# EAGLE design DTUnodeSchematic (EAGLE 8.0.0)

## Sheet 1 of 3
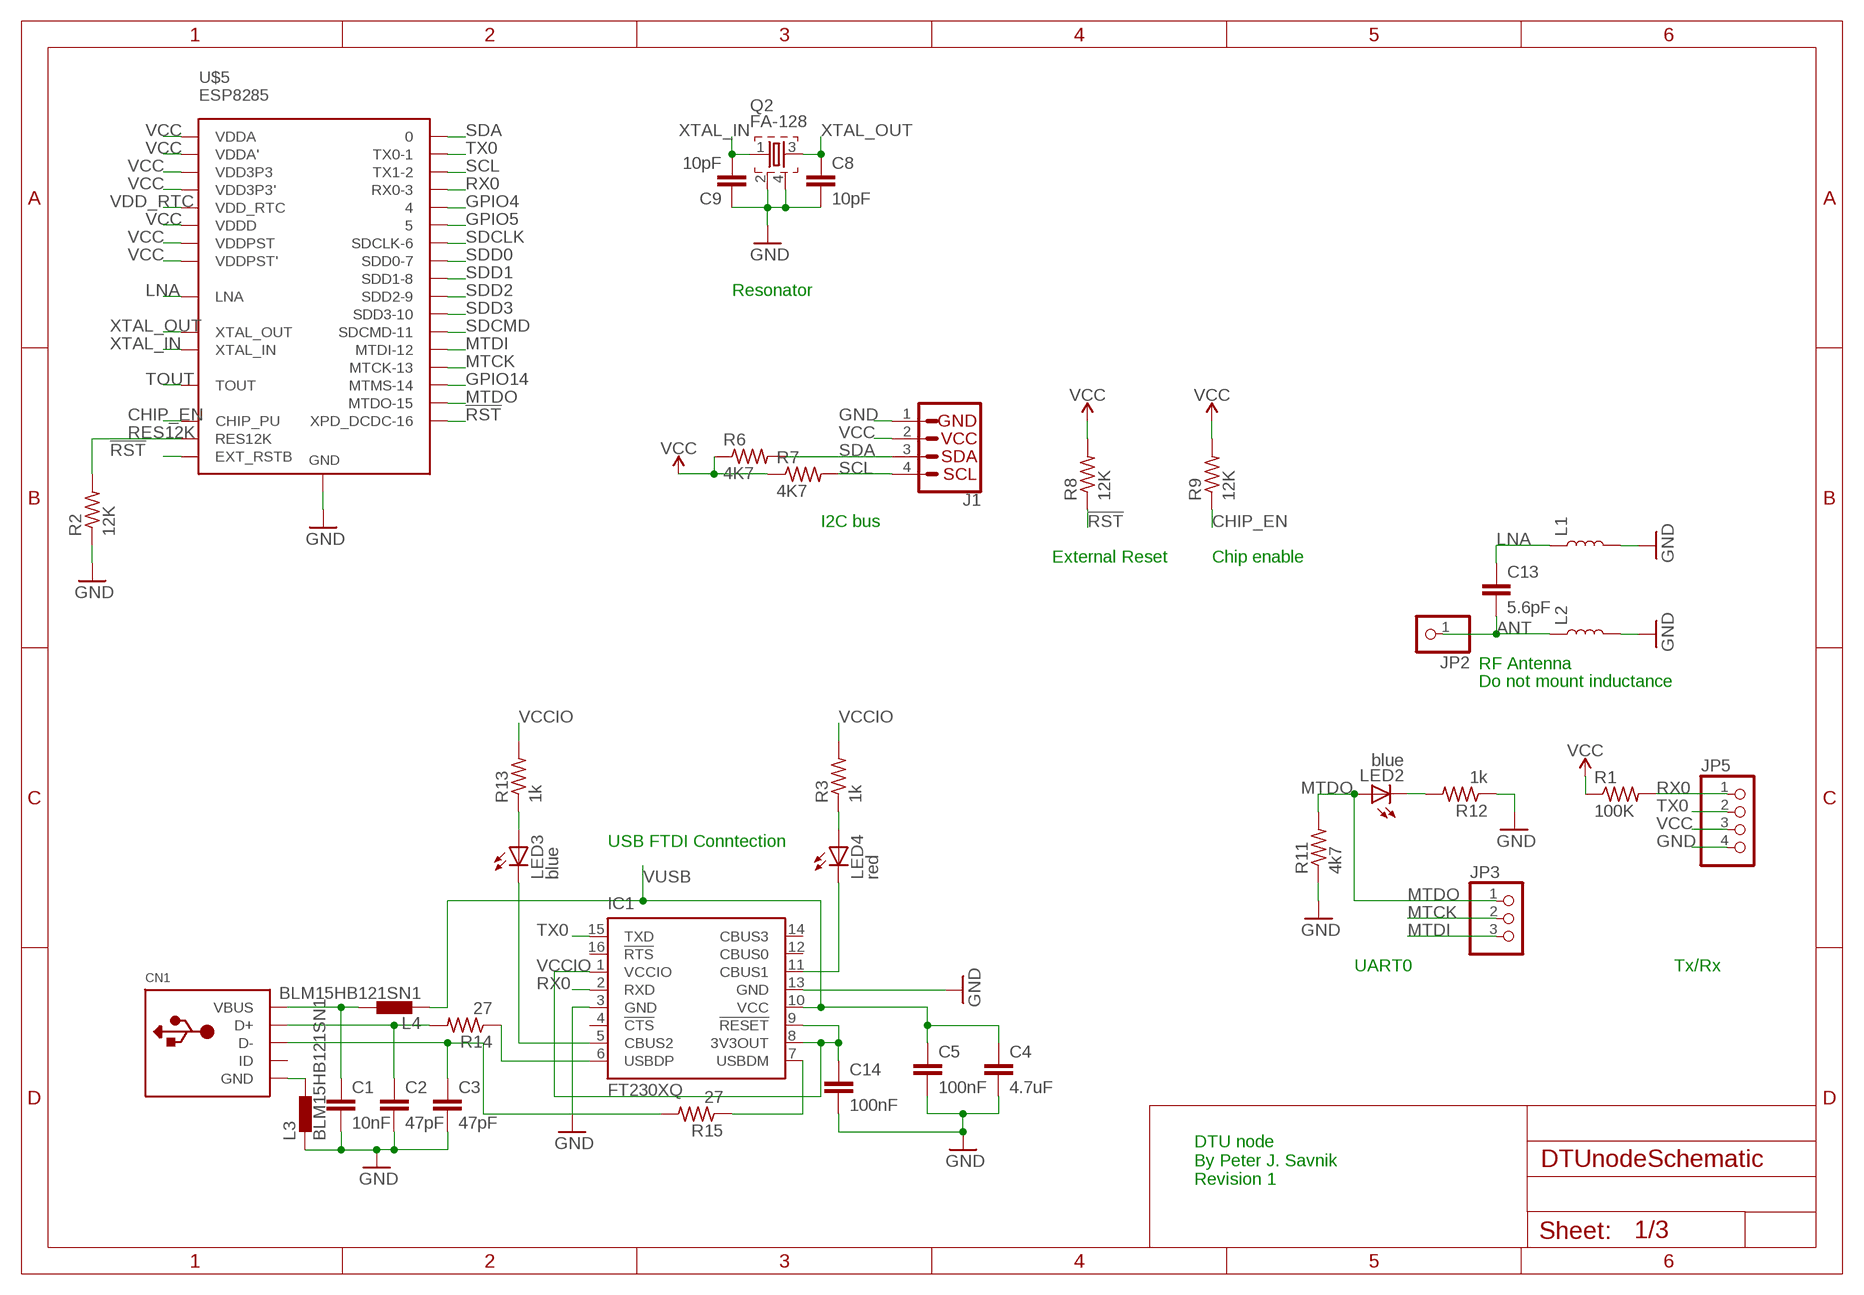
[diagram p0: schematic, sheet 1]

### Parts
C1  10nF  C-EUC0402K  [C0402K]
C2  47pF  C-EUC0402K  [C0402K]
C3  47pF  C-EUC0402K  [C0402K]
C4  4.7uF  C-EUC0402K  [C0402K]
C5  100nF  C-EUC0402K  [C0402K]
C8  10pF  C-EUC0402K  [C0402K]
C9  10pF  C-EUC0402K  [C0402K]
C13  5.6pF  C-EUC0402K  [C0402K]
C14  100nF  C-EUC0402K  [C0402K]
CN1  USBMINIB  [USB-MINIB]
IC1  FT230XQ  [QFN16]
J1  I2C_STANDARD  [1X04]
JP2  PINHD-1X1  [1X01]
JP3  PINHD-1X3  [1X03]
JP5  PINHD-1X4  [1X04]
L1  INDUCTOR-0402-3.9NH  [0402]
L2  INDUCTOR-0402-3.9NH  [0402]
L3  BLM15HB121SN1  [0402]
L4  BLM15HB121SN1  [0402]
LED2  blue  LEDCHIP-LED0603  [CHIP-LED0603]
LED3  blue  LEDCHIP-LED0603  [CHIP-LED0603]
LED4  red  LEDCHIP-LED0603  [CHIP-LED0603]
Q2  FA-128  [FA-128]
R1  100K  R-US_R0402  [R0402]
R2  12K  R-US_R0402  [R0402]
R3  1k  R-US_R0402  [R0402]
R6  4K7  R-US_R0402  [R0402]
R7  4K7  R-US_R0402  [R0402]
R8  12K  R-US_R0402  [R0402]
R9  12K  R-US_R0402  [R0402]
R11  4k7  R-US_R0402  [R0402]
R12  1k  R-US_R0402  [R0402]
R13  1k  R-US_R0402  [R0402]
R14  27  R-US_R0402  [R0402]
R15  27  R-US_R0402  [R0402]
U$5  ESP8285  [QFN-32]

### Nets
!RST: R8.1 U$5.P$8(XPD_DCDC-16) U$5.P$32(EXT_RSTB)
ANT: C13.2 JP2.1 L2.1
CHIP_EN: R9.1 U$5.P$7(CHIP_PU)
GND: C1.2 C2.2 C3.2 C4.2 C5.2 C8.2 C9.1 C14.2 IC1.3(GND) IC1.13(GND) J1.1 JP5.4 L1.2 L2.2 L3.1 Q2.2 Q2.4 R2.1 R11.1 R12.1 U$5.33-GND(GND) ; also sheet 2,3
GPIO4: U$5.P$16
GPIO5: U$5.P$24
GPIO14: U$5.P$9(MTMS-14)
LNA: C13.1 L1.1 U$5.P$2(LNA)
MTCK: JP3.2 U$5.P$12(MTCK-13)
MTDI: JP3.3 U$5.P$10(MTDI-12)
MTDO: JP3.1 LED2.A R11.2 U$5.P$13(MTDO-15)
N$1: CN1.GND L3.2
N$2: IC1.6(USBDP) R14.1
N$4: C1.1 CN1.VBUS L4.2
N$5: C2.1 CN1.D+ R14.2
N$7: C3.1 CN1.D- R15.2
N$8: LED2.C R12.2
N$9: IC1.7(USBDM) R15.1
N$16: LED3.A R13.1
N$17: LED4.A R3.1
N$18: IC1.5(CBUS2) LED3.C
N$19: IC1.11(CBUS1) LED4.C
RES12K: R2.2 U$5.P$31(RES12K)
RX0: IC1.2(RXD) R1.2 U$5.P$25(RX0-3)
SCL: J1.4 R7.2 U$5.P$14(TX1-2) ; also sheet 3
SDA: J1.3 R6.2 U$5.P$15 ; also sheet 3
SDCLK: U$5.P$21(SDCLK-6)
SDCMD: U$5.P$20(SDCMD-11)
SDD0: U$5.P$22(SDD0-7)
SDD1: U$5.P$23(SDD1-8)
SDD2: U$5.P$18(SDD2-9)
SDD3: U$5.P$19(SDD3-10)
TOUT: U$5.P$6(TOUT) ; also sheet 2
TX0: IC1.15(TXD) JP5.2 U$5.P$26(TX0-1)
VCC: J1.2 JP5.3 R1.1 R6.1 R7.1 R8.2 R9.2 U$5.P$1(VDDA) U$5.P$3(VDD3P3) U$5.P$4(VDD3P3') U$5.P$11(VDDPST) U$5.P$17(VDDPST') U$5.P$29(VDDD) U$5.P$30(VDDA') ; also sheet 2,3
VCCIO: C14.1 IC1.1(VCCIO) IC1.8(3V3OUT) IC1.9(!RESET) R3.2 R13.2
VDD_RTC: U$5.P$5(VDD_RTC)
VUSB: C4.1 C5.1 IC1.10(VCC) L4.1 ; also sheet 2
XTAL_IN: C9.2 Q2.1 U$5.P$28(XTAL_IN)
XTAL_OUT: C8.1 Q2.3 U$5.P$27(XTAL_OUT)
Unconnected: CN1.ID IC1.4(!CTS) IC1.12(CBUS0) IC1.14(CBUS3) IC1.16(!RTS) JP5.1

### Notes on the sheet
- Resonator
- I2C bus
- External Reset | Chip enable
- RF Antenna
- Do not mount inductance
- USB FTDI Conntection
- UART0 | Tx/Rx
- DTU node
  By Peter J. Savnik
  Revision 1

## Sheet 2 of 3
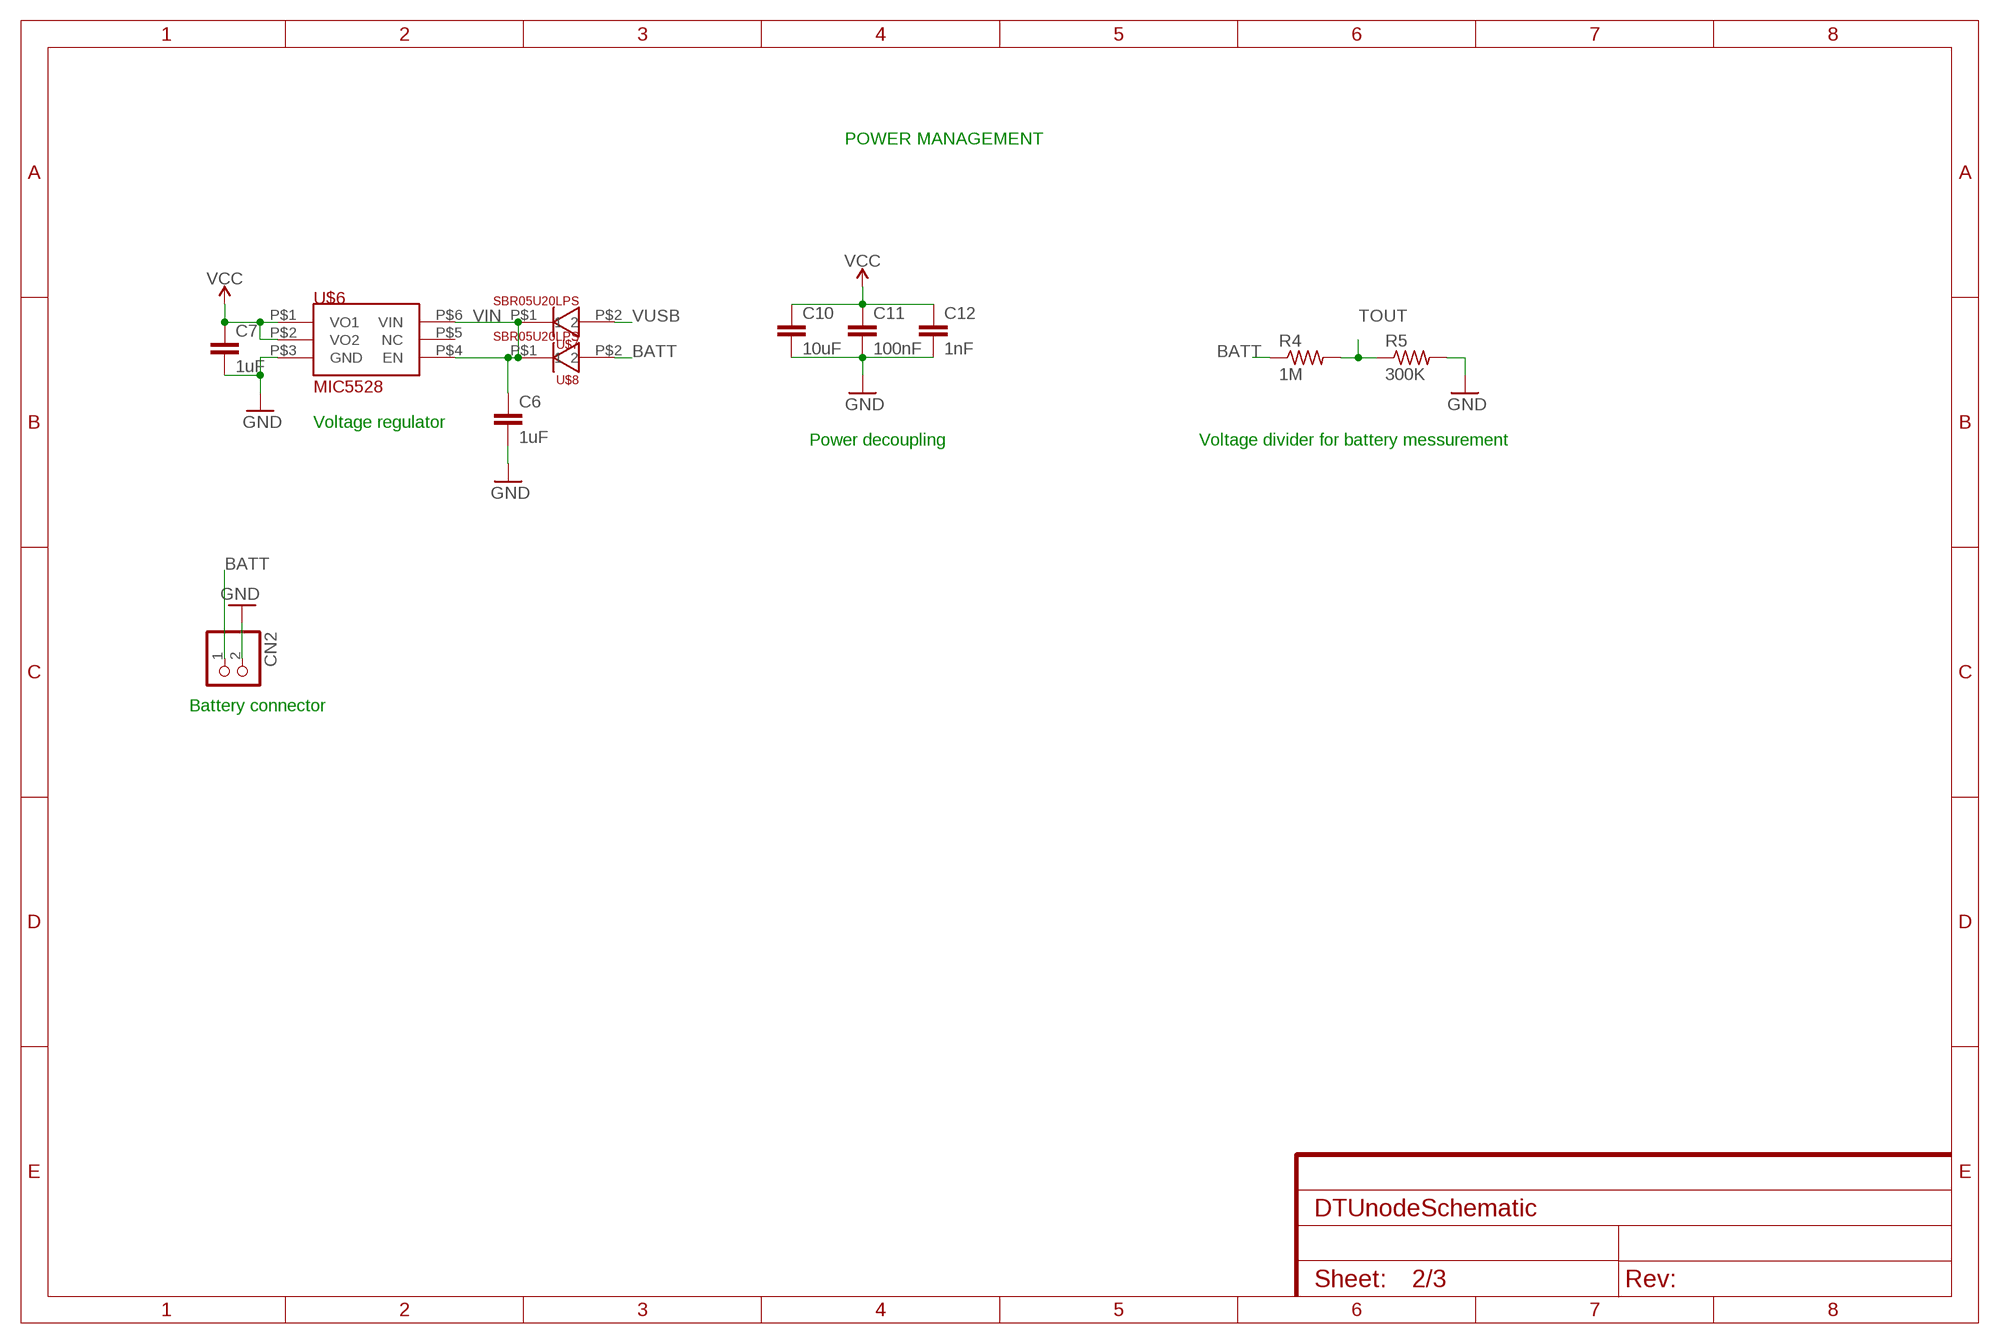
[diagram p1: schematic, sheet 2]

### Parts
C6  1uF  C-EUC0402K  [C0402K]
C7  1uF  C-EUC0402K  [C0402K]
C10  10uF  C-EUC0402K  [C0402K]
C11  100nF  C-EUC0402K  [C0402K]
C12  1nF  C-EUC0402K  [C0402K]
CN2  JST_2PIN-THM-RA  [JST-PH-2-THM-RA]
R4  1M  R-US_R0402  [R0402]
R5  300K  R-US_R0402  [R0402]
U$6  MIC5528  [6-PIN_1.2MMX1.2MM_THIN_FDN(MT)]
U$7  SBR05U20LPS  [X2-DFN1006-2]
U$8  SBR05U20LPS  [X2-DFN1006-2]

### Nets
BATT: CN2.1 R4.1 U$8.P$2
GND: C6.2 C7.2 C10.2 C11.2 C12.2 CN2.2 R5.2 U$6.P$3(GND) ; also sheet 1,3
TOUT: R4.2 R5.1 ; also sheet 1
VCC: C7.1 C10.1 C11.1 C12.1 U$6.P$1(VO1) U$6.P$2(VO2) ; also sheet 1,3
VIN: C6.1 U$6.P$4(EN) U$6.P$6(VIN) U$7.P$1 U$8.P$1
VUSB: U$7.P$2 ; also sheet 1
Unconnected: U$6.P$5(NC)

### Notes on the sheet
- POWER MANAGEMENT
- Voltage regulator
- Power decoupling | Voltage divider for battery messurement
- Battery connector

## Sheet 3 of 3
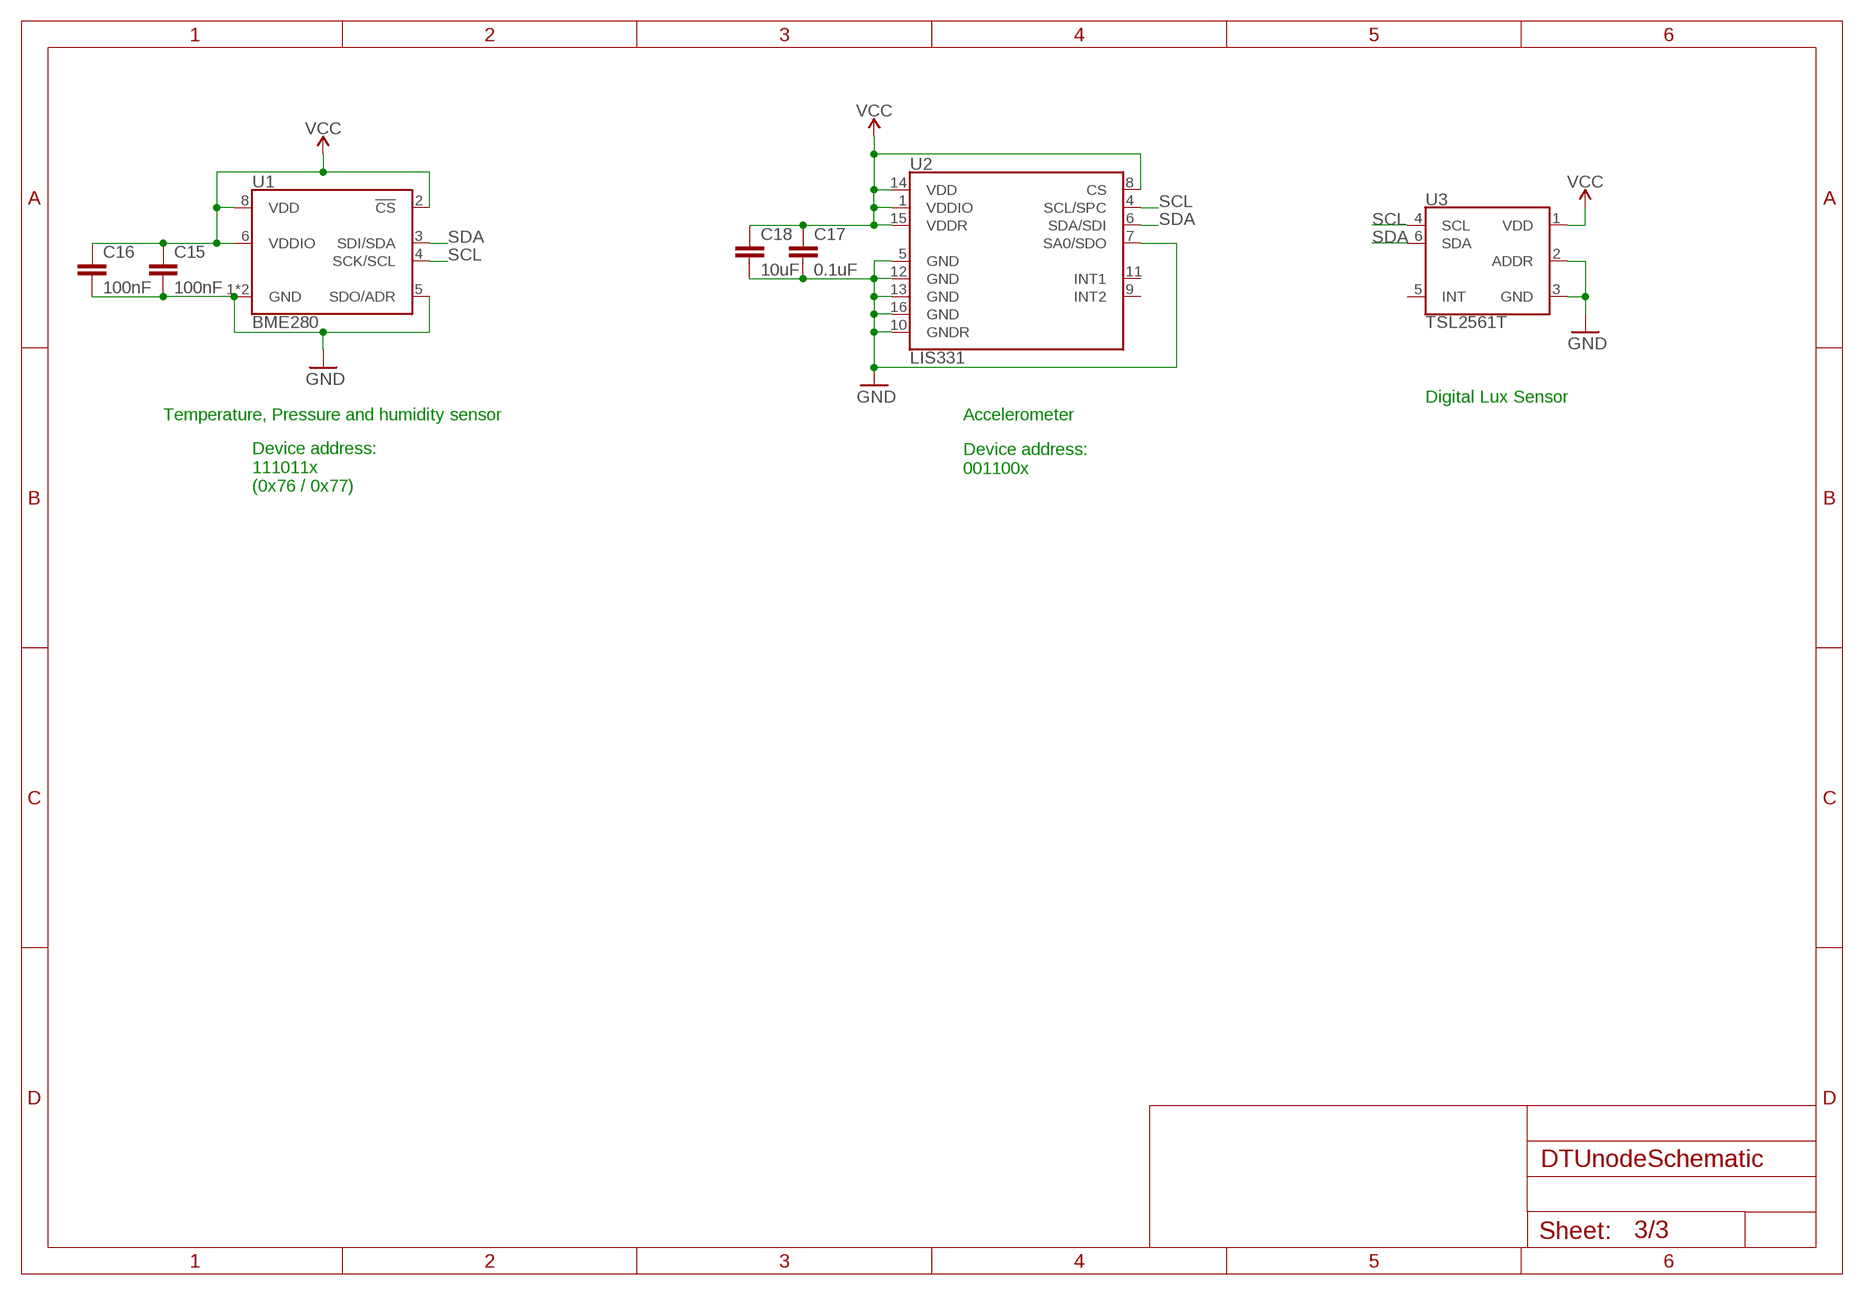
[diagram p2: schematic, sheet 3]

### Parts
C15  100nF  C-EUC0402  [C0402]
C16  100nF  C-EUC0402  [C0402]
C17  0.1uF  C-EUC0402  [C0402]
C18  10uF  C-EUC0402  [C0402]
U1  BME280  [LGA-8-2.5X2.5]
U2  LIS331  [LGA-16-3X3]
U3  TSL2561T  [TMB-6]

### Nets
GND: C15.2 C16.2 C17.2 C18.2 U1.1(GND) U1.5(SDO/ADR) U1.7(GND) U2.5(GND) U2.7(SA0/SDO) U2.10(GNDR) U2.12(GND) U2.13(GND) U2.16(GND) U3.2(ADDR) U3.3(GND) ; also sheet 1,2
SCL: U1.4(SCK/SCL) U2.4(SCL/SPC) U3.4(SCL) ; also sheet 1
SDA: U1.3(SDI/SDA) U2.6(SDA/SDI) U3.6(SDA) ; also sheet 1
VCC: C15.1 C16.1 C17.1 C18.1 U1.2(!CS) U1.6(VDDIO) U1.8(VDD) U2.1(VDDIO) U2.8(CS) U2.14(VDD) U2.15(VDDR) U3.1(VDD) ; also sheet 1,2
Unconnected: U2.9(INT2) U2.11(INT1) U3.5(INT)

### Notes on the sheet
- Digital Lux Sensor
- Temperature, Pressure and humidity sensor | Accelerometer
- Device address:
  001100x
- Device address:
  111011x
  (0x76 / 0x77)

## Library data of the parts
C1 = resistor:C-EU: CAPACITOR, European symbol; MF: MULTICOMP; MPN: MC1206B103K102CT; OC_FARNELL: 1855902
C2-C14 = resistor:C-EU: CAPACITOR, European symbol; OC_FARNELL: unknown
C15-C18 = resistor:C-EU: CAPACITOR, European symbol
CN1 = adafruit:USB: USB Connectors USBMINIB - Surface Mount Female Mini-B USB Connector 4UConnector: 06564 By microbuilder.eu Thru-hole RA Female Mini-B USB Connector 4UConnector: 18732 By ladyada.net; OC_FARNELL: unknown
CN2 = adafruit:JST_2PIN: JST 2-Pin Connectors of various flavors SMT-RA (S2B-PH-SM4) 4UConnector #17311 SMT (B2B-PH-SM4) THM-RA (S2B-PH) THM (B2B-PH); OC_FARNELL: unknown
IC1 = ftdichip:FT230X: USB to BASIC UART IC Auto generated by make-symbol-device-package-bsdl.ulp Rev. 43 Source: Data sheet <http://www.ftdichip.com/Support/Documents/DataSheets/ICs/DS_FT230X.pdf>; OC_FARNELL: unknown
J1 = SparkFun-Connectors:I2C_STANDARD: SparkFun I2C Standard Pinout Header SparkFun has standardized on a pinout for all I2C based sensor breakouts. This pinout allows I2C boards to be plugged directly into the headers on Arduino Uno compatible boards, and to be daisy chained easily. Example SparkFun Products: SparkFun Atmospheric Sensor Breakout - BME280 <https://www.sparkfun.com/products/13676> SparkFun Altitude/Pressure Sensor Breakout - MPL3115A2 <https://www.sparkfun.com/products/11084> SparkFun TOF Range Finder Sensor - VL6180 <https://www.sparkfun.com/products/12785>
JP2 = adafruit:PINHD-1X1: Pin header 1x1 for 0.1" spacing With round pins; OC_FARNELL: unknown
JP3 = adafruit:PINHD-1X3: PIN HEADER; OC_FARNELL: unknown
JP5 = pinhead:PINHD-1X4: PIN HEADER
L1 L2 = SparkFun-Coils:INDUCTOR: Inductors Resist changes in electrical current. Basically a coil of wire. SparkFun Products: SparkFun Load Cell Amplifier - HX711 <https://www.sparkfun.com/products/13879> IOIO-OTG - V2.2 <https://www.sparkfun.com/products/13613>; OC_FARNELL: unknown; PROD_ID: NDUC-13457; VALUE: 3.9NH
L3 L4 = inductors:BLM15H: EMIFIL (R) Chip Ferrite Bead for GHz Noise Source: http://www.murata.com/ Ferrite Bead BLM15H.pdf; OC_FARNELL: unknown
LED2-LED4 = adafruit:LED: LED OSRAM: - CHIPLED LG R971, LG N971, LY N971, LG Q971, LY Q971, LO R971, LY R971 LH N974, LH R974 LS Q976, LO Q976, LY Q976 LO Q996 - Hyper CHIPLED LW Q18S LB Q993, LB Q99A, LB R99A - SideLED LS A670, LO A670, LY A670, LG A670, LP A670 LB A673, LV A673, LT A673, LW A673 LH A674 LY A675 LS A676, LA A676, LO A676, LY A676, LW A676 LS A679, LY A679, LG A679 - Hyper Micro SIDELED® LS Y876, LA Y876, LO Y876, LY Y876 LT Y87S - SmartLED LW L88C, LW L88S LB L89C, LB L89S, LG L890 LS L89K, LO L89K, LY L89K LS L896, LA L896, LO L896, LY L896 - TOPLED LS T670, LO T670, LY T670, LG T670, LP T670 LSG T670, LSP T670, LSY T670, LOP T670, LYG T670 LG T671, LOG T671, LSG T671 LB T673, LV T673, LT T673, LW T673 LH T674 LS T676, LA T676, LO T676, LY T676, LB T676, LH T676, LSB T676, LW T676 LB T67C, LV T67C, LT T67C, LS T67K, LO T67K, LY T67K, LW E67C LS E67B, LA E67B, LO E67B, LY E67B, LB E67C, LV E67C, LT E67C LW T67C LS T679, LY T679, LG T679 LS T770, LO T770, LY T770, LG T770, LP T770 LB T773, LV T773, LT T773, LW T773 LH T774 LS E675, LA E675, LY E675, LS T675 LS T776, LA T776, LO T776, LY T776, LB T776 LHGB T686 LT T68C, LB T68C - Hyper Mini TOPLED® LB M676 - Mini TOPLED Santana® LG M470 LS M47K, LO M47K, LY M47K Source: http://www.osram.convergy.de/; OC_FARNELL: unknown
Q2 = crystal:FA-: MHz RANGE CRYSTAL UNIT Source: Epson Toyocom; OC_FARNELL: unknown
R1-R9 R11-R15 = resistor:R-US_: RESISTOR, American symbol; OC_FARNELL: unknown
U1 = SparkFun-Sensors:BME280: Bosch BME280 – Combined Humidity and Pressure Sensor The BME280 is as combined digital humidity, pressure and temperature sensor based on proven sensing principles. The sensor module is housed in an extremely compact metal-lid LGA package with a footprint of only 2.5×2.5mm² with a height of 0.93mm. Its small dimensions and its low power consumption allow the implementation in battery driven devices such as handsets, GPS modules or watches. Datasheet <https://cdn.sparkfun.com/assets/learn_tutorials/4/1/9/BST-BME280_DS001-10.pdf> SparkFun Products SparkFun Atmospheric Sensor Breakout - BME280 <https://www.sparkfun.com/products/13676> (SEN-13676); PROD_ID: IC-13090
U2 = SparkFun-Sensors:LIS331: ST Microelectronics LIS331 3-Axis ±6/12/24g SPI/I2C Accelerometer The LIS331HH is an ultra low-power full-scale three axis MEMS linear accelerometer. It has a digital I2C/SPI serial interface which makes it ideal for using in embedded applications. The device also features ultra low-power operational modes that allow advanced power saving and smart sleep to wake-up functions. Datasheet <http://www.sparkfun.com/datasheets/Sensors/Accelerometer/LIS331HH.pdf> SparkFun Products SparkFun Triple Axis Accelerometer Breakout - LIS331 <https://www.sparkfun.com/products/10345> (SEN-10345) Triple Axis Accelerometer - LIS331HH <https://www.sparkfun.com/products/9755> (SEN-09755); PROD_ID: IC-12675; SF_ID: COM-09755
U3 = SparkFun-Sensors:TSL2561: TAOS TSL2561 Digital Luminosity (Light) Sensor The TSL2561 is a light-to-digital converter that transform light intensity to a digital signal output via I2C interface. The device combines one broadband photodiode (visible plus infrared) and one infrared-responding photodiode on a single CMOS integrated circuit capable of providing a near-photopic response over an effective 20-bit dynamic range (16-bit resolution). Two integrating ADCs convert the photodiode currents to a digital output that represents the irradiance measured on each channel. This digital output can be input to a microprocessor where illuminance (ambient light level) in lux is derived using an empirical formula to approximate the human eye response. The TSL2561 device supports a traditional level style interrupt that remains asserted until the firmware clears it. Datasheet <http://www.mouser.com/ds/2/588/ams_sl2560-e58-488842.pdf> SparkFun Products SparkFun Luminosity Sensor Breakout - TSL2561 <https://www.sparkfun.com/products/12055> (SEN-12055)
U$5 = Ma-ESP8285:ESP8285: ESP8285 Microcontroller with wifi and 1M flash by Espressif; OC_FARNELL: unknown
U$6 = micrel:MIC5528: Microchip Technology MIC5528 500mA High-Performance LDO Microchip MIC5528 500mA High-Performance LDO is a low-power, µCap, low dropout regulator designed for optimal performance in a very small footprint. It is capable of sourcing up to 500mA of output current while only drawing 38µA of operating current. This high-performance LDO is a µCap design in a thermally enhanced 1.2mmx1.2mm extra thin (0.4mm height) DFN package. It operates with small ceramic output capacitor for stability, thereby reducing required board space. Ideal for battery-operated applications, the MIC5528 offers ±2% accuracy, extremely low dropout voltage (260mV @ 500mA), and can regulate output voltage down to 1.0V. Equipped with a TTL logic-compatible enable pin, the MIC5528 can be put into a zero-off-mode current state, drawing no current when disabled.; OC_FARNELL: unknown
U$7 U$8 = Diodes_Inc_By_element14_Batch_1:SBR05U20LPS: SURFACE MOUNT SUPER BARRIER RECTIFIER Ultra-Low Forward Voltage Drop Superior Reverse Avalanche Capability Patented Super Barrier Rectifier Technology Soft, Fast Switching Capability +150°C Operating Junction Temperature Totally Lead-Free & Fully RoHS Compliant (Notes 1 & 2) Halogen and Antimony Free. “Green” Device (Note 3); OC_FARNELL: unknown

## Board
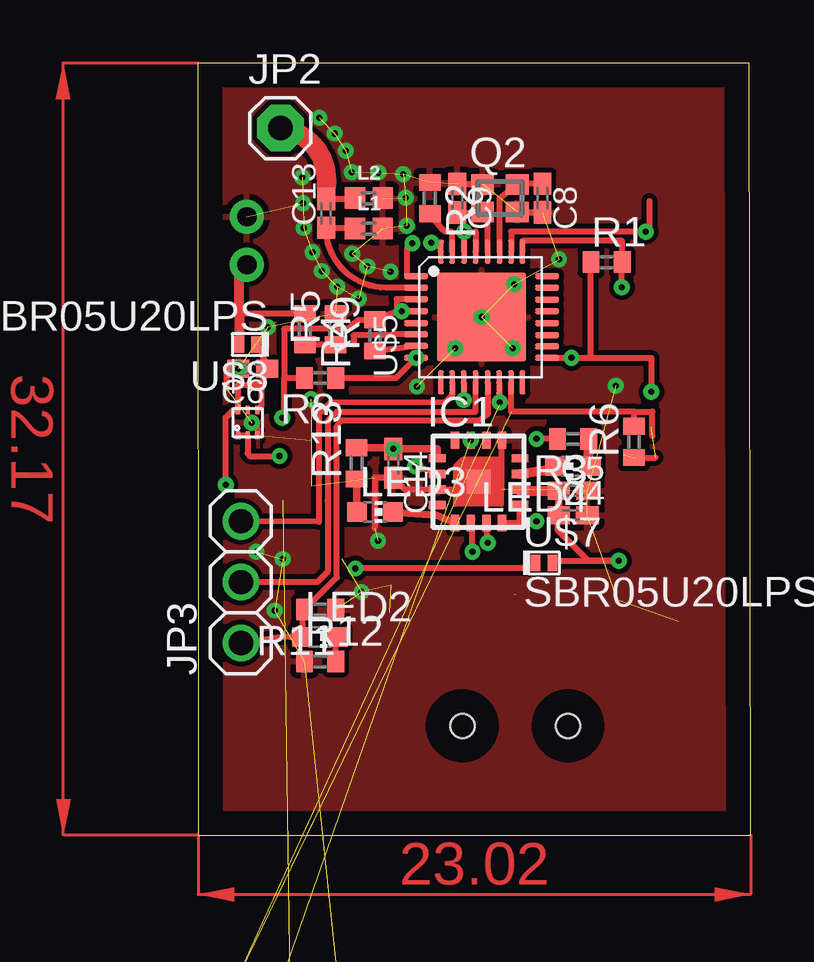
[diagram p3: board, top side]
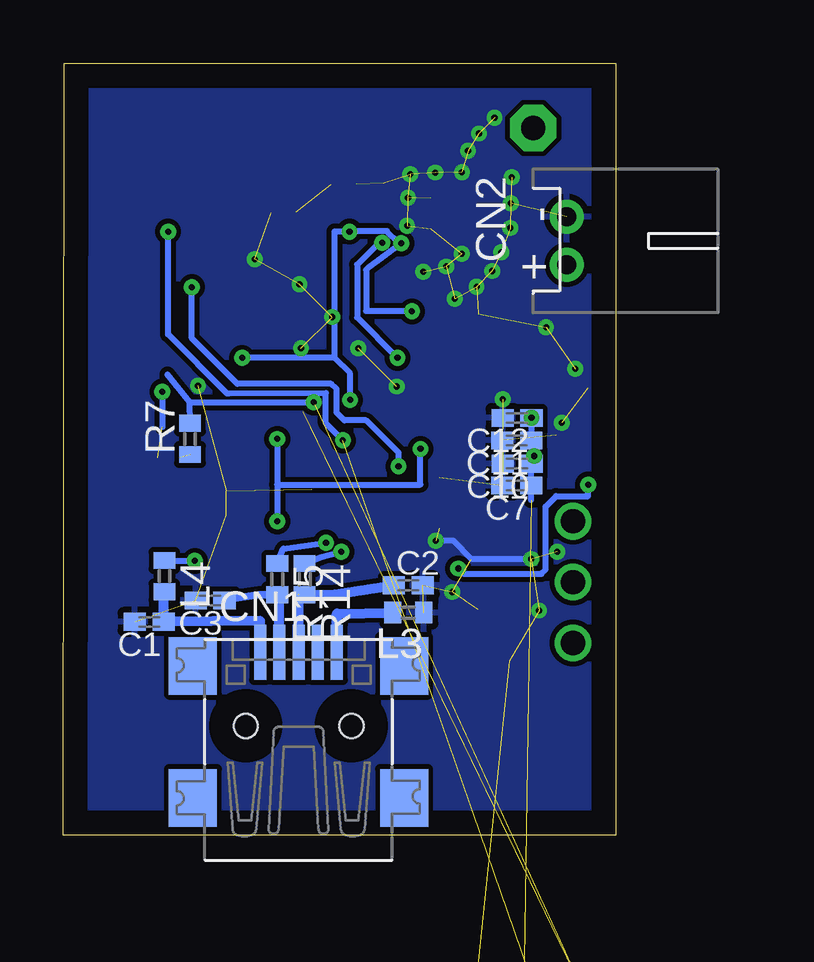
[diagram p4: board, bottom side, seen from below]

Size 23.03 x 32.17 mm. Coordinates in mm from the lower left corner, seen from the top.
Outline: 0.01,0 23.03,0 22.98,32.16 0,32.17 0.01,0
Copper layers (1*16): Top 0.035mm / dielectric 1.5mm / Bottom 0.035mm
Design rules "default": minimum track width 10mil, minimum drill 24mil, track to track 8mil, track to pad 8mil, pad to pad 8mil, via to via 8mil, smd to smd 8mil, copper to edge 40mil, drill to drill 8mil, minimum pad ring 10mil, minimum via ring 8mil, stop-mask expansion 4mil, vias tented up to drill 0mil, thermal gap 10mil

### Footprints (pad centres in the part's own frame; a part is rotated, then mirrored left to right if it is on the bottom)
C0402K = smd 0.925 x 0.74: 1 -0.6,0; 2 0.6,0
C0402 = smd 0.7 x 0.9: 1 -0.65,0; 2 0.65,0
USB-MINIB = smd 0.5 x 2.308: D+ 0,4.064; D- -0.8,4.064; GND 1.6,4.064; ID 0.8,4.064; VBUS -1.6,4.064 | smd 2 x 2.4: GND1 -4.4,-2; GND2 -4.4,3.5; GND3 4.4,3.5; GND4 4.4,-2 | hole 1: -2.2,1; 2.2,1
JST-PH-2-THM-RA = drill 0.8 pad 1.422: 1 1,0; 2 -1,0
QFN16 = smd 0.7 x 0.35: 1 -1.725,0.975; 2 -1.725,0.325; 3 -1.725,-0.325; 4 -1.725,-0.975; 9 1.725,-0.975; 10 1.725,-0.325; 11 1.725,0.325; 12 1.725,0.975 | smd 0.35 x 0.7: 5 -0.975,-1.725; 6 -0.325,-1.725; 7 0.325,-1.725; 8 0.975,-1.725; 13 0.975,1.725; 14 0.325,1.725; 15 -0.325,1.725; 16 -0.975,1.725 | smd 1 x 1: TAB 0,0
1X04 = drill 1.016 pad 1.88: 1 0,0; 2 2.54,0; 3 5.08,0; 4 7.62,0
1X01 = drill 1.016 pad 1.93 octagon: 1 0,0
1X03 = drill 1.016: 1 -2.54,0; 2 0,0; 3 2.54,0
1X04' = drill 1.016 long: 1 -3.81,0; 2 -1.27,0; 3 1.27,0; 4 3.81,0
0402 = smd 0.85 x 0.9: 1 -0.58,0; 2 0.58,0
0402' = smd 0.7 x 0.9: 1 -0.65,0; 2 0.65,0
CHIP-LED0603 = smd 0.8 x 0.8: A 0,-0.75; C 0,0.75
FA-128 = smd 0.95 x 0.85: 1 -0.725,-0.575; 2 0.725,-0.575; 3 0.725,0.575; 4 -0.725,0.575
R0402 = smd 0.7 x 0.9: 1 -0.65,0; 2 0.65,0
LGA-8-2.5X2.5 = smd 0.35 x 0.5: 1 -0.975,1.025; 2 -0.325,1.025; 3 0.325,1.025; 4 0.975,1.025; 5 0.975,-1.025; 6 0.325,-1.025; 7 -0.325,-1.025; 8 -0.975,-1.025
LGA-16-3X3 = smd 0.7 x 0.28: 1 -1.4,1; 2 -1.4,0.5; 3 -1.4,0; 4 -1.4,-0.5; 5 -1.4,-1; 9 1.4,-1; 10 1.4,-0.5; 11 1.4,0; 12 1.4,0.5; 13 1.4,1 | smd 0.28 x 0.7: 6 -0.5,-1.4; 7 0,-1.4; 8 0.5,-1.4; 14 0.5,1.4; 15 0,1.4; 16 -0.5,1.4
TMB-6 = smd 1.6 x 0.7: 1 -1.8,0.95; 2 -1.8,0; 3 -1.8,-0.95; 4 1.8,-0.95; 5 1.8,0; 6 1.8,0.95
QFN-32 = smd 3.7 x 3.7: 33-GND 0,0 | smd 0.25 x 1: P$1 1.7,2.725; P$2 1.225,2.725; P$3 0.75,2.725; P$4 0.25,2.725; P$5 -0.25,2.725; P$6 -0.725,2.725; P$7 -1.2,2.725; P$8 -1.7,2.725; P$17 -1.7,-2.725; P$18 -1.225,-2.725; P$19 -0.75,-2.725; P$20 -0.25,-2.725; P$21 0.25,-2.725; P$22 0.725,-2.725; P$23 1.225,-2.725; P$24 1.7,-2.725 | smd 1 x 0.25: P$9 -2.725,1.7; P$10 -2.725,1.225; P$11 -2.725,0.75; P$12 -2.725,0.25; P$13 -2.725,-0.25; P$14 -2.725,-0.725; P$15 -2.725,-1.225; P$16 -2.725,-1.7; P$25 2.725,-1.7; P$26 2.725,-1.225; P$27 2.725,-0.75; P$28 2.725,-0.25; P$29 2.725,0.25; P$30 2.725,0.725; P$31 2.725,1.225; P$32 2.725,1.7
6-PIN_1.2MMX1.2MM_THIN_FDN(MT) = smd 0.18 x 0.35: P$1 0,0; P$2 0.4,0; P$3 0.8,0; P$4 0,1.05; P$5 0.4,1.05; P$6 0.8,1.05
X2-DFN1006-2 = smd 0.4 x 0.7: P$1 0,0; P$2 0.7,0

### Placement (x,y rotation side)
C1  19.44,8.89 180 bottom
C2  8.65,10.41 0 bottom
C3  16.9,9.78 180 bottom
C4  15.63,13.34 0 top
C5  15.63,14.35 0 top
C6  2.29,19.43 180 top
C7  4.13,14.57 180 bottom
C8  14.36,26.54 270 top
C9  10.81,26.54 270 top
C10  4.11,15.48 180 bottom
C11  4.13,16.45 180 bottom
C12  4.11,17.39 180 bottom
C13  5.35,25.91 90 top
C14  8.14,15.49 270 top
C15  -11.47,-56.1 0 top  (outside the outline)
C16  -11.47,-59.93 0 top  (outside the outline)
C17  -16.61,-64.68 0 top  (outside the outline)
C18  -16.61,-69.43 0 top  (outside the outline)
CN1  13.22,3.56 0 bottom
CN2  2.04,24.77 270 bottom
IC1  11.7,14.73 0 top
J1  -3.57,-44.36 0 top  (outside the outline)
JP2  3.44,29.46 0 top
JP3  1.79,10.54 90 top
JP5  [1X04']  2.64,-12.1 0 top  (outside the outline)
L1  7.12,25.27 0 top
L2  7.12,26.54 0 top
L3  BLM15HB121SN1  [0402']  8.65,9.27 180 bottom
L4  BLM15HB121SN1  [0402']  18.81,10.79 270 bottom
LED2  5.09,8.26 270 top
LED3  7.38,13.46 270 top
LED4  15.63,15.37 90 top
Q2  12.59,26.54 0 top
R1  17.03,23.88 0 top
R2  9.66,26.54 270 top
R3  15.63,16.51 180 top
R4  4.46,21.08 270 top
R5  5.73,21.08 90 top
R6  18.17,16.38 90 top
R7  17.74,16.51 90 bottom
R8  5.09,19.05 180 top
R9  7.38,20.83 90 top
R11  5.09,9.4 180 top
R12  5.09,7.24 0 top
R13  6.62,15.49 90 top
R14  12.97,10.67 270 bottom
R15  14.11,10.67 270 bottom
U1  -11.1,-32.63 0 top  (outside the outline)
U2  -15.54,-59.63 0 top  (outside the outline)
U3  -13.64,-74.54 0 top  (outside the outline)
U$5  11.82,21.59 90 top
U$6  1.68,16.66 0 top
U$7  14.07,11.34 0 top
U$8  2.43,20.45 180 top

### Tracks (layer width: path | path; a pad name or v marks a point on that pad's centre or on a via)
!RST  (via drill 0.25 pad 0.25)
  Top 0.254: R8.1 8.26,19.05 U$5.P$8 | U$5.P$32 10.12,24.69 v9.73,24.69
  Bottom 0.254: v9.73,24.69 9.87,24.69 10.78,23.77 10.78,21.57 U$5.P$8
  other vias: 9.1,19.89
ANT
  Top 0.254: 5.35,27.05 C13.2 6.51,26.51 arc90 L2.1
  Top 0.813: 5.35,27.05 arc90 JP2.1
BATT
  Top 0.254: R4.1 1.73,21.73 1.73,21.59
  Top 0.406: CN2.1 1.73,23.77 1.73,21.59 U$8.P$2
CHIP_EN
  Top 0.254: R9.1 U$5.P$7
GND  (via drill 0.25 pad 0.25)  (68 unrouted)
  Top 0.254: C9.1 11.84,27.14 arc-90 Q2.4 | C8.2 13.34,25.94 arc-90 Q2.2 | IC1.13 12.67,14.41 IC1.3 8.63,14.41 C14.2 7.37,14.89 7.37,12.79 | C6.2 1.18,19.43 1.18,18.62 | U$5.33-GND 10.73,21.59 v10.73,20.28 | v2.25,17.18 2.48,16.95 U$6.P$3
  Bottom 0.254: v3.53,11.51 6.02,11.51 6.78,12.27 v7.51,12.27
  other vias: 15.05,24 9.13,18.69 11.82,21.59 13.12,20.29 13.18,22.96 2.44,11.81 3.2,9.36 2.91,21.16 8.7,25.4 8.66,26.56 8.56,27.53 7.52,27.61 6.41,27.62 8.03,23.48 7.06,23.7 6.43,24.23 6.71,22.35 5.8,22.85 5.16,23.51 4.78,24.3 4.41,25.3 4.38,26.33 4.34,27.42 6.16,28.51 5.7,29.24 5.05,29.9 1.69,19.43 17.41,18.72 4.71,18.16 6.82,10.13
  pour Bottom: -0.77,33.19 26.12,33.19 26.12,-1.57 -0.77,-1.57
  pour Top: -1.8,34.43 27.75,34.43 27.75,-2.17 -1.8,-2.17
LNA
  Top 0.254: U$5.P$2 7.84,22.82 arc-90 C13.1 6.51,25.31 arc-90 L1.1
MTCK
  Top 0.254: 2.04,10.54 JP3.2 4.98,10.54 5.41,10.97 5.41,13.95 5.42,17.27 5.8,17.65 11.57,17.65 U$5.P$12
MTDI
  Top 0.254: U$5.P$10 10.6,18.33 10.3,18.03 5.51,18.01 5.04,17.54 5.04,13.07 | 5.04,13.06 5.04,13.07 | 5.04,13.07 JP3.3
MTDO
  Top 0.254: U$5.P$13 12.07,17.52 11.7,17.27 5.98,17.27 5.79,17.06 5.79,10.75 R11.2 4.34,9.4 LED2.A 3.82,8.26 3.58,8.27 JP3.1
N$1
  Bottom 0.406: 11.58,7.62 CN1.GND 11.62,9.23 L3.2
N$2  (via drill 0.25 pad 0.25)
  Top 0.254: v11.44,11.81 11.44,13.19 IC1.6
  Bottom 0.254: R14.1 12.32,11.57 v11.44,11.81
N$4
  Bottom 0.406: 14.86,7.62 CN1.VBUS 14.82,8.93 C1.1 18.84,9.83 L4.2
N$5  (1 unrouted)
  Bottom 0.406: 13.22,10.03 12.84,10.03 | CN1.D+ 13.22,10.02 R14.2 12.85,10.02 11.7,10.03 C2.1
N$7
  Bottom 0.305: R15.2 14.87,10.02 15.89,9.87 C3.1
  Bottom 0.406: CN1.D- 14.02,10.18 R15.2
N$8
  Top 0.254: R12.2 5.74,8.15 LED2.C
N$9  (via drill 0.25 pad 0.25)
  Top 0.254: v12.08,12.19 IC1.7
  Bottom 0.254: R15.1 13.86,11.94 v12.08,12.19
N$16
  Top 0.305: R13.1 6.63,14.84 LED3.A
N$17
  Top 0.406: LED4.A 16.28,15.62 R3.1
N$18
  Top 0.305: LED3.C 9.96,13.34 IC1.5
N$19
  Top 0.406: IC1.11 14.56,15.23 LED4.C
RES12K
  Top 0.254: U$5.P$31 10.6,25.1 10.55,25.15 10.3,25.15 10.17,25.27 R2.2
RX0  (via drill 0.25 pad 0.25)
  Top 0.254: U$5.P$25 13.52,24.77 17.68,24.77 R1.2 17.67,23.86 v17.67,22.84 | IC1.2 v9.05,15.37
  Bottom 0.254: v9.05,15.37 9.05,15.94 10.4,17.29 11.32,17.29 11.63,17.6 11.63,18.59 11.85,18.81 15.77,18.81 17.67,20.7 v17.67,22.84
SCL  (via drill 0.25 pad 0.25)  (4 unrouted)
  Top 0.254: U$5.P$14 12.55,17.94 v12.59,18.03
  Bottom 0.254: 17.75,18.05 v12.59,18.03 | 17.75,18.05 18.68,19.2 | R7.2 17.75,18.05
SDA  (4 unrouted)
  Top 0.254: 18.94,16.64 18.94,17.65 18.17,17.65 | 18.17,17.65 13.05,17.65 U$5.P$15 | R6.2 18.17,17.65
TOUT
  Top 0.254: R4.2 R5.1 5.73,20.45 6.49,20.45 6.49,20.83 8.14,20.83 8.14,20.86 U$5.P$6
TX0  (via drill 0.25 pad 0.25)  (1 unrouted)
  Top 0.254: U$5.P$26 13.05,25.15 v18.66,25.15 18.81,25.15 18.81,26.42
  Bottom 0.254: IC1.15 12.08,17.16 12.08,18.41 16.13,18.4 16.19,18.4 18.66,20.87 v18.66,25.15
  other vias: 11.37,16.46
VCC  (via drill 0.25 pad 0.25)  (16 unrouted)
  Top 0.254: U$5.P$30 v11.1,25.15 11.57,25.15 U$5.P$29 | 8.28,21.82 R9.2 7.35,21.45 6.64,21.45 6.25,21.09 3.59,21.09 3.59,19.05 | 8.28,21.82 v8.5,21.82 U$5.P$4 | U$5.P$3 8.28,22.34 8.28,21.82 | R6.1 19.08,15.73 | U$5.P$17 v15.57,19.89 | v15.57,19.89 16.38,19.89 R1.1 | U$5.P$1 8.72,23.29 8.72,24.45 v8.94,24.66 | 3.59,19.05 R8.2 | U$6.P$1 U$6.P$2 2.07,15.9 2.17,15.8 v3.4,15.8 | C12.1 3.59,17.47 3.59,19.05 | U$5.P$11 v11.07,18.14 | v15.57,19.89 18.9,19.89 v18.9,18.48
  Bottom 0.254: 10.97,25.27 v11.1,25.15 | v8.5,21.82 8.52,21.85 10.4,21.85 10.4,21.84 10.4,23.56 10.32,23.64 v8.94,24.66 9.03,24.66 9.54,25.17 11.07,25.17 v11.1,25.15 | v11.1,25.15 11.06,25.15 | C10.1 3.53,15.49 C11.1 3.53,17.37 C12.1 | C10.1 3.4,15.59 v3.4,15.8 | C10.1 C7.1 3.53,13.96 | v11.07,18.14 11.07,19.24 11.72,19.89 | 11.72,19.89 v15.57,19.89 | v11.1,25.15 11.72,25.15 11.72,19.89 | 18.81,18.48 v18.9,18.48 18.9,17.02
  other vias: 3.51,17.39
VCCIO  (via drill 0.25 pad 0.25)
  Top 0.254: IC1.8 13.42,13.01 13.42,13.08 | 13.42,13.08 IC1.9 | R3.2 v14.11,16.51 | v14.11,13.08 13.42,13.08
  Top 0.305: IC1.1 9.97,16.09 C14.1 8.14,16.14 R13.2
  Bottom 0.254: v14.11,16.51 14.11,14.61 | 14.11,14.61 v14.11,13.08 | 14.11,14.61 8.14,14.61 C14.1
  other vias: 8.14,16.09
VIN  (via drill 0.25 pad 0.25)
  Top 0.254: U$8.P$1 2.64,20.23 C6.1 2.64,18.77 | U$6.P$6 2.64,17.88 2.64,18.77 | 2.64,18.77 1.68,18.77 U$6.P$4 1.47,17.71 1.16,17.4 v1.16,14.61 | U$7.P$1 13.84,11.11 v6.57,11.11
  Bottom 0.254: v6.57,11.11 6.34,10.88 3.1,10.88 2.92,11.06 2.92,13.69 2.49,14.12 1.16,14.12 v1.16,14.61
VUSB  (via drill 0.25 pad 0.25)
  Top 0.254: C4.1 15,13.3 15,12.7 16.27,11.43 v17.54,11.43 14.86,11.43 U$7.P$2
  Top 0.305: 13.42,14.35 IC1.10 | C4.1 C5.1
  Top 0.406: 13.42,14.35 C5.1
  Bottom 0.254: L4.1 17.55,11.45 v17.54,11.43
XTAL_IN
  Top 0.254: U$5.P$28 12.07,25.75 Q2.1 arc-90 11.84,25.94 C9.2
XTAL_OUT
  Top 0.254: U$5.P$27 12.57,26.53 12.59,26.54 Q2.3 arc-90 13.34,27.14 C8.1
(copper drawn outside any net)
  shapes: Top area x2